# EAGLE design SensorBoard (EAGLE 7.3.0)
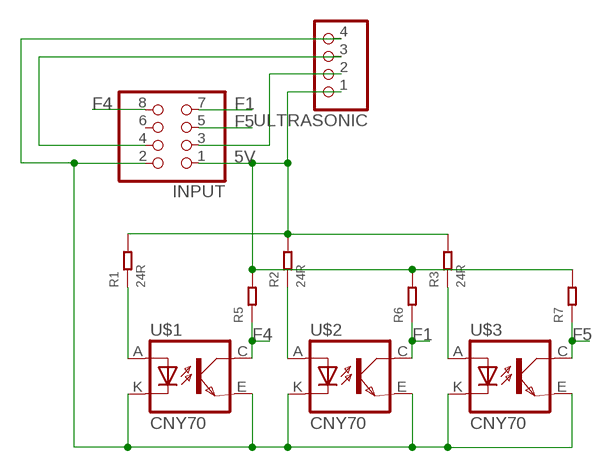
[diagram p0: schematic, sheet 1]

## Parts
INPUT  PINHD-2X4  [2X04]
R1  24R  DIP-RES-0R-5%-1/4W(2P-D2.3XL6.5MM)  [PR-D2.3XL6.5MM]
R2  24R  DIP-RES-0R-5%-1/4W(2P-D2.3XL6.5MM)  [PR-D2.3XL6.5MM]
R3  24R  DIP-RES-0R-5%-1/4W(2P-D2.3XL6.5MM)  [PR-D2.3XL6.5MM]
R5  DIP-RES-0R-5%-1/4W(2P-D2.3XL6.5MM)  [PR-D2.3XL6.5MM]
R6  DIP-RES-0R-5%-1/4W(2P-D2.3XL6.5MM)  [PR-D2.3XL6.5MM]
R7  DIP-RES-0R-5%-1/4W(2P-D2.3XL6.5MM)  [PR-D2.3XL6.5MM]
U$1  CNY70  [4]
U$2  CNY70  [4]
U$3  CNY70  [4]
ULTRASONIC  PINHD-1X4  [1X04]

## Nets
5V: INPUT.1 R1.2 R2.2 R3.2 R5.2 R6.2 R7.2 ULTRASONIC.1
F1: INPUT.7 R6.1 U$2.C(COL)
F4: INPUT.8 R5.1 U$1.C(COL)
F5: INPUT.5 R7.1 U$3.C(COL)
GND: INPUT.2 U$1.E(EMI) U$1.K(C) U$2.E(EMI) U$2.K(C) U$3.E(EMI) U$3.K(C) ULTRASONIC.4
N$1: R2.1 U$2.A
N$2: INPUT.3 ULTRASONIC.2
N$4: INPUT.4 ULTRASONIC.3
N$5: R3.1 U$3.A
N$6: R1.1 U$1.A
Unconnected: INPUT.6

## Library data of the parts
INPUT = pinhead:PINHD-2X4: PIN HEADER
R1-R3 R5-R7 = Seeed-OPL-Resistor:DIP-RES-0R-5%-1/4W(2P-D2.3XL6.5MM): 301020004; MPN: FHCFR-1/4W-000J; VALUE: 0R
U$1-U$3 = cny70:CNY70
ULTRASONIC = pinhead:PINHD-1X4: PIN HEADER

## Board
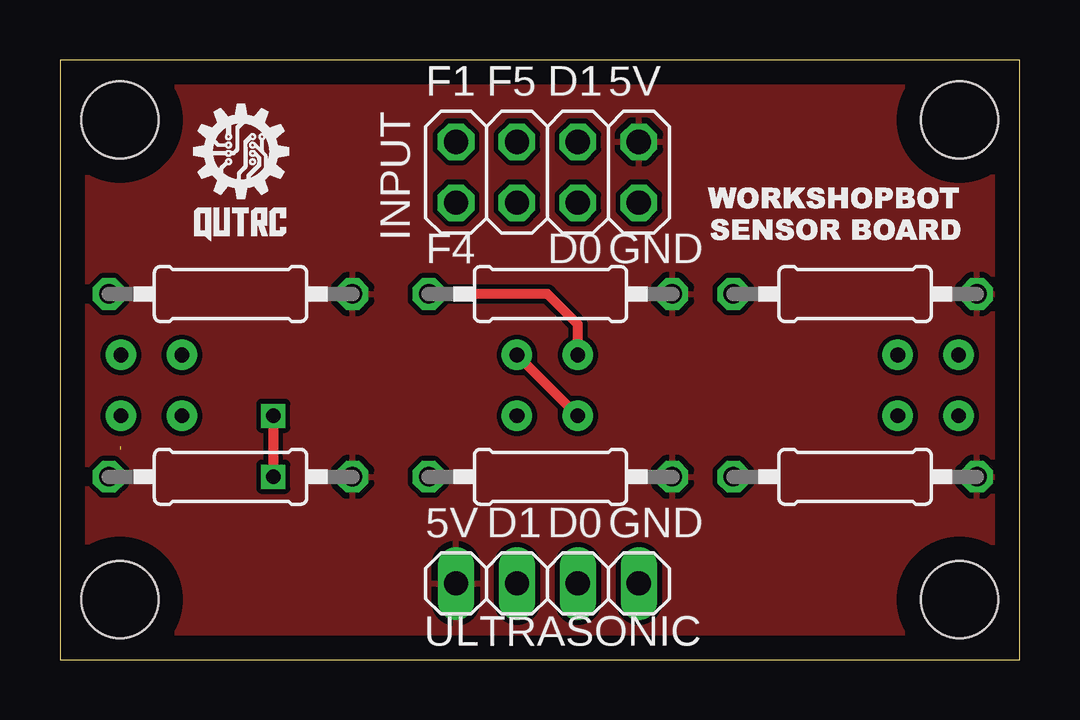
[diagram p1: board, top side]
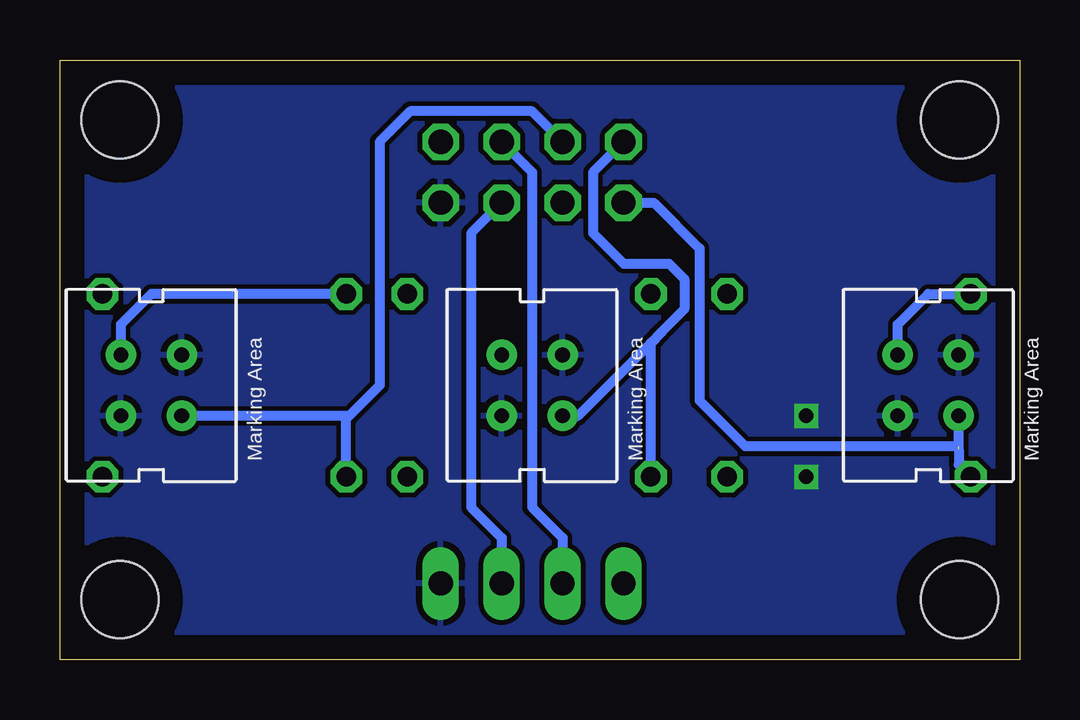
[diagram p2: board, bottom side, seen from below]

Size 40 x 25 mm. Coordinates in mm from the lower left corner, seen from the top.
Outline: 0,0 40,0 40,25 0,25 0,0
Copper layers (1*16): Top 0.035mm / dielectric 1.5mm / Bottom 0.035mm
Design rules "default": minimum track width 10mil, minimum drill 24mil, track to track 8mil, track to pad 8mil, pad to pad 8mil, via to via 8mil, smd to smd 8mil, copper to edge 40mil, drill to drill 8mil, minimum pad ring 10mil, minimum via ring 8mil, stop-mask expansion 4mil, vias tented up to drill 0mil, thermal gap 10mil
Holes 3.2 mm at 2.5,2.5 37.5,2.5 2.5,22.5 37.5,22.5

### Footprints (pad centres in the part's own frame; a part is rotated, then mirrored left to right if it is on the bottom)
2X04 = drill 1.016 octagon: 1 -3.81,-1.27; 2 -3.81,1.27; 3 -1.27,-1.27; 4 -1.27,1.27; 5 1.27,-1.27; 6 1.27,1.27; 7 3.81,-1.27; 8 3.81,1.27
PR-D2.3XL6.5MM = drill 0.813 octagon: 1 -4.953,0; 2 5.207,0
4 = drill 0.61 pad 1.27: A -1.27,1.27; C 1.27,-1.27; E 1.27,1.27; K -1.27,-1.27
1X04 = drill 1.016 long: 1 -3.81,0; 2 -1.27,0; 3 1.27,0; 4 3.81,0

### Placement (x,y rotation side)
INPUT  20.32,20.32 180 top
R1  6.99,15.24 0 top
R2  20.32,15.24 0 top
R3  33.02,15.24 0 top
R5  6.99,7.62 0 top
R6  20.32,7.62 0 top
R7  33.02,7.62 0 top
U$1  3.81,11.43 0 bottom
U$2  20.32,11.43 0 bottom
U$3  36.2,11.43 0 bottom
U$4  [LOGO21]  4.45,15.88 0 top
U$5  [LOGO22]  26.67,17.14 0 top
ULTRASONIC  20.32,3.17 0 top

### Tracks (layer width: path | path; a pad name or v marks a point on that pad's centre or on a via)
5V
  pour Top: 0,24.77 40.01,24.77 40.01,0 0,0
F1
  Bottom 0.406: INPUT.7 17.78,20.32 17.78,17.78 16.51,16.51 14.61,16.51 13.97,15.88 13.97,14.61 14.92,13.65 15.37,13.21 | U$2.C 18.41,10.16 15.37,13.21 | R6.1 15.37,13.21
F4  (1 unrouted)
  Bottom 0.406: INPUT.8 15.24,19.05 13.34,17.14 13.34,10.79 11.43,8.89 2.54,8.89 U$1.C | 2.54,8.76 2.54,8.13 R5.1
F5
  Bottom 0.406: INPUT.5 20.32,22.86 25.4,22.86 26.67,21.59 26.67,11.43 27.94,10.16 | 27.94,10.16 U$3.C | R7.1 28.07,10.03 27.94,10.16
GND  (via drill 0.6)
  Top 0.406: U$2.E U$2.K | v8.89,10.16 v8.89,7.62
  pour Bottom: 0,24.77 40.01,24.77 40.01,0 0,0
N$1
  Top 0.406: U$2.A 21.59,13.97 20.32,15.24 R2.1
N$2
  Bottom 0.406: INPUT.3 20.32,20.32 20.32,6.35 19.05,5.08 ULTRASONIC.2
N$4
  Bottom 0.406: INPUT.4 22.86,17.78 22.86,6.35 21.59,5.08 ULTRASONIC.3
N$5
  Bottom 0.406: R3.1 36.2,15.24 37.47,13.97 U$3.A
N$6
  Bottom 0.406: U$1.A 5.08,13.97 3.81,15.24 R1.1

### Text on the board
tPlace: F1 | F5 | D1 | 5V | F4 | D0 | GND | 5V | D1 | D0 | GND